# EasyEDA schematic Heizoel.Fuellstand.json
TITLE: Heizoel.Fuellstand; REV: 1.0; Date: 2019-01-28; Sheet: 1/1; Drawn By: Stefan Burkhardt; Company: Private
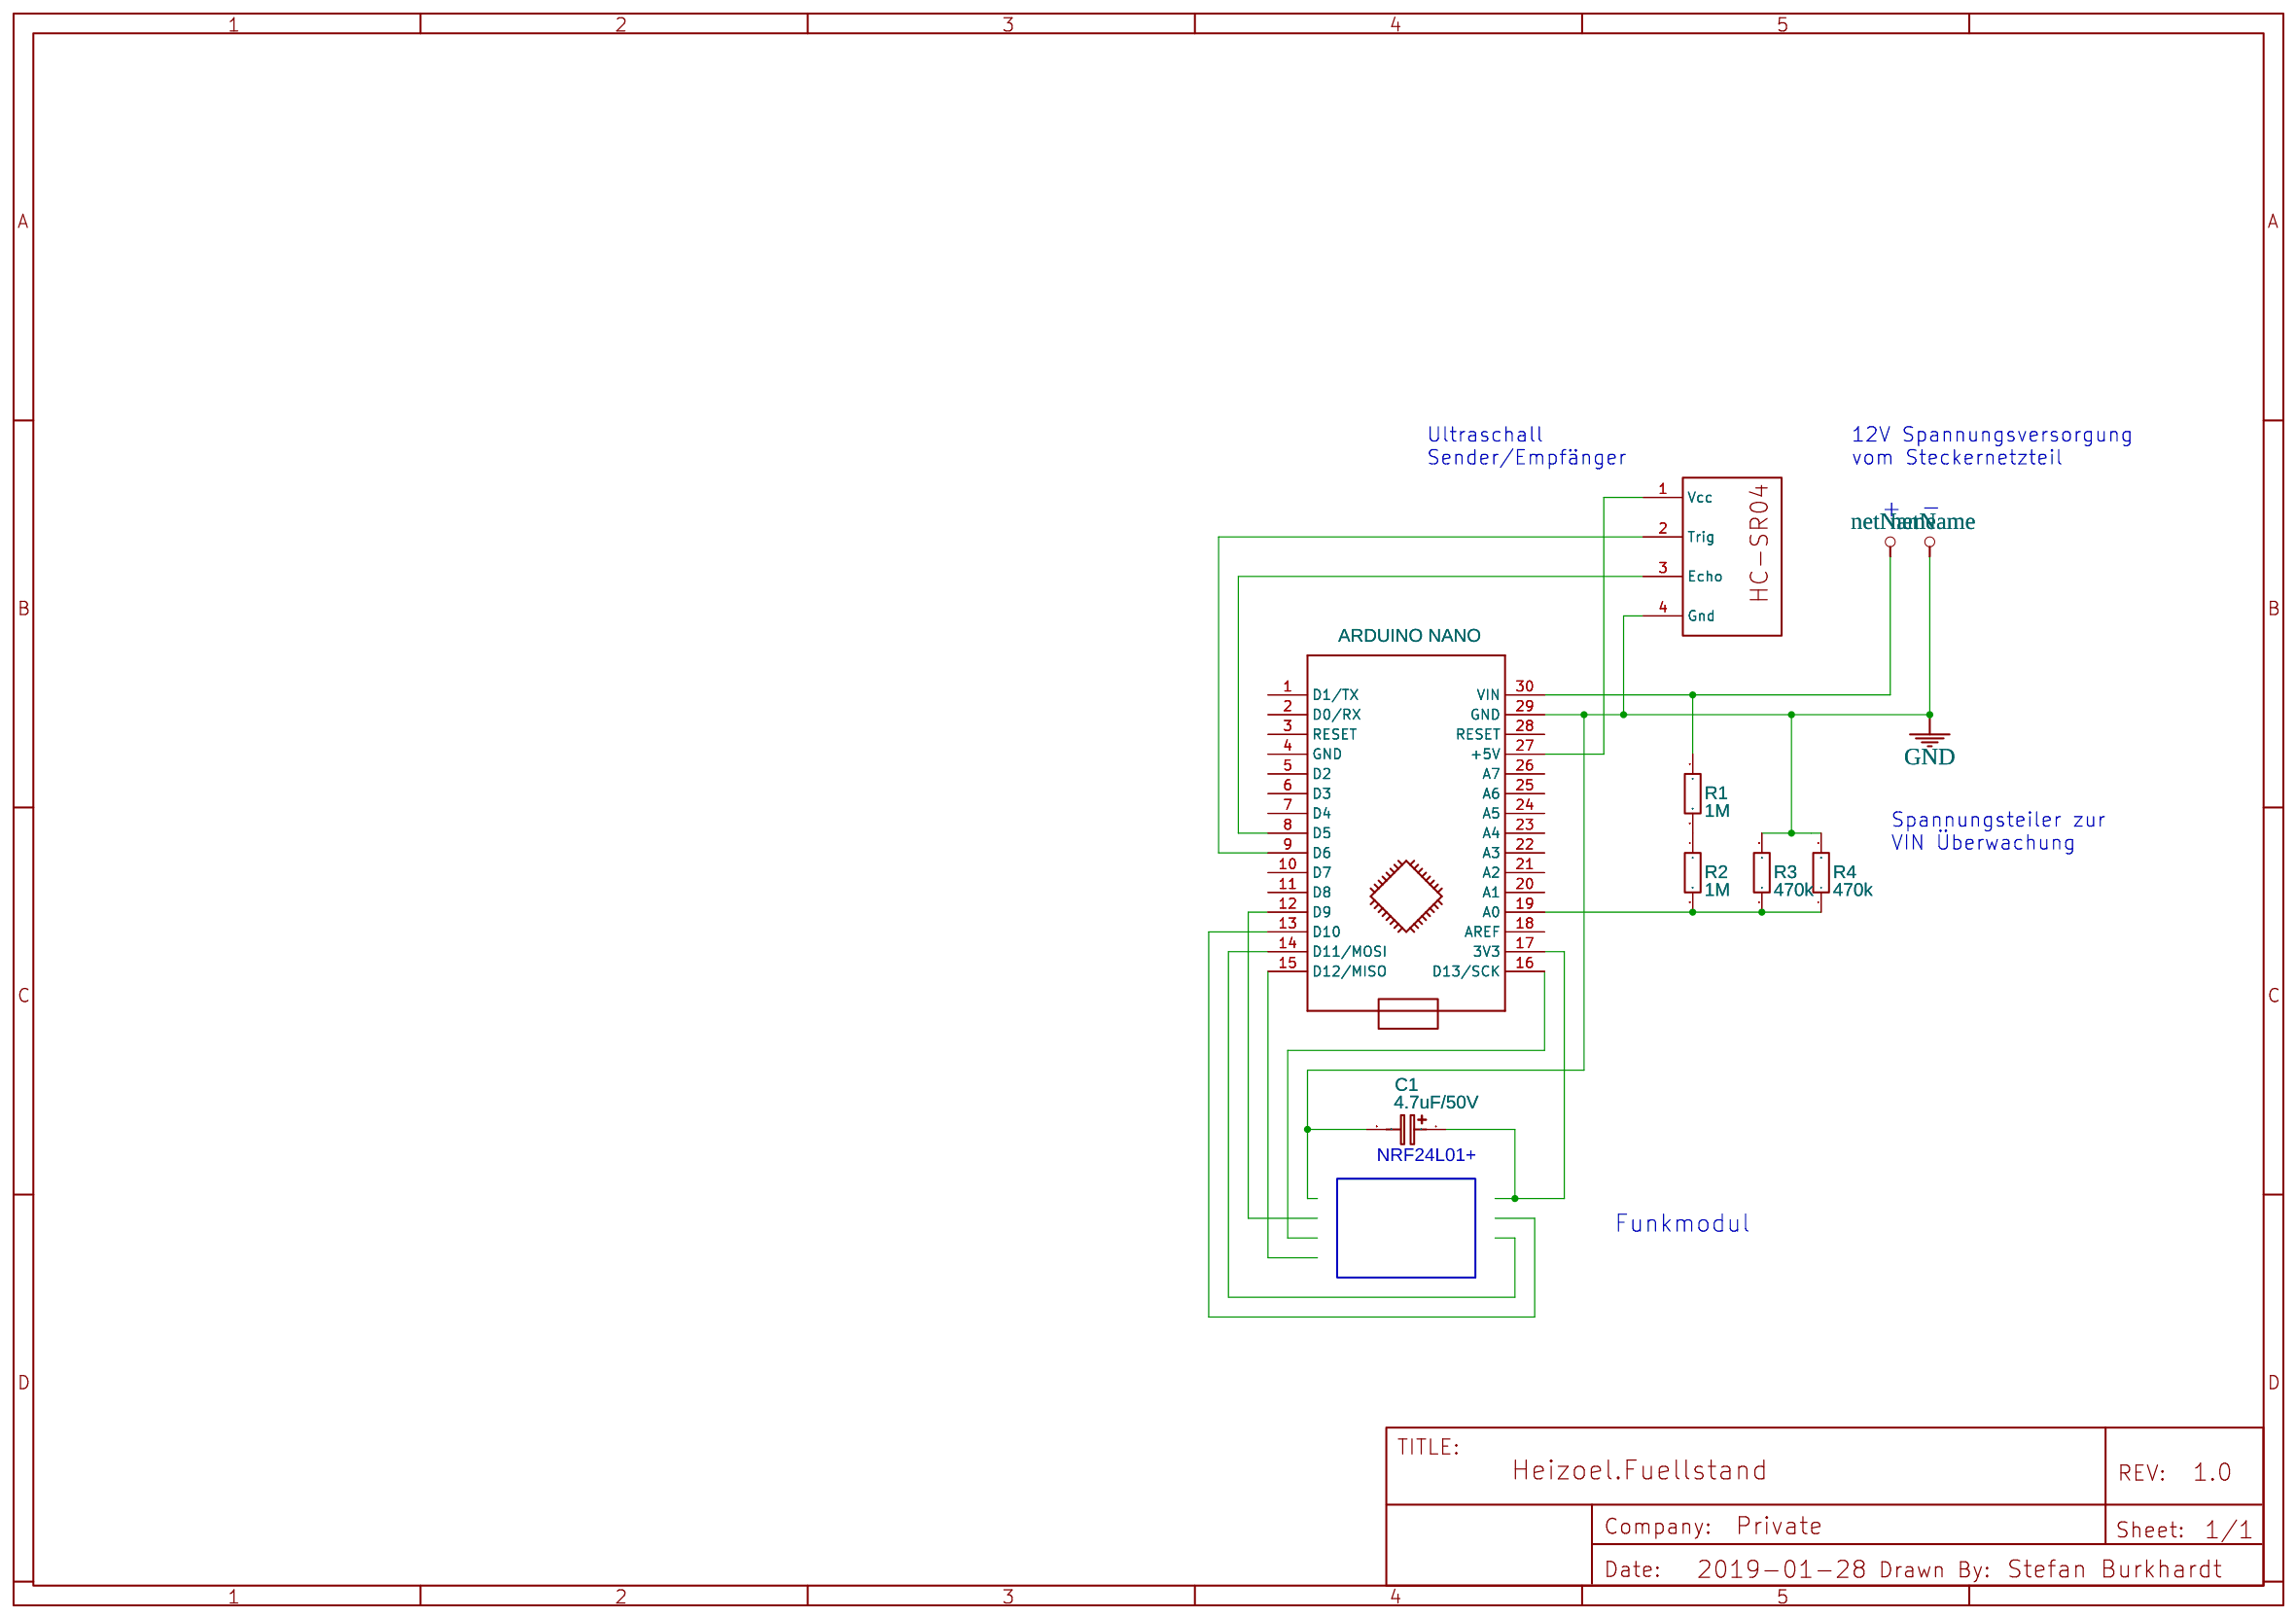
[diagram p0: schematic sheet]

## Parts
C1  4.7uF/50V  [CAP-D3.0XF1.5]
R1  1M  [AXIAL-0.3]
R2  1M  [AXIAL-0.3]
R3  470k  [AXIAL-0.3]
R4  470k  [AXIAL-0.3]
U1  ARDUINO NANO  [ARDUINO_NANO]
U3  HC-SR04

## Library data of the parts
C1 = Cap_Electrolytic(TH)_D3.0XF1.5_EU: Contributor: EasyEDA; Manufacturer Part: ?
R1-R4 = Res_AXIAL-0.3(1/8W)_EU: Manufacturer Part: ?
U1 = -: sourceId: KGSeAWhDB; Manufacturer Part: ?
U3 = -: Contributor: MrSpock

## Nets
GND: C1.2 R1.1 R3.2 R4.2 U1.29(GND) U1.30(VIN) U3.4(Gnd)
Net-(C1-1): C1.1 U1.17(3V3)
Net-(R1-2): R1.2 R2.1
Net-(R2-2): R2.2 R3.1 R4.1 U1.19(A0)
Net-(U1-8): U1.8(D5) U3.3(Echo)
Net-(U1-9): U1.9(D6) U3.2(Trig)
Net-(U1-27): U1.27(+5V) U3.1(Vcc)

Not connected (* = marked no-connect by the designer): U1 1(D1/TX) 2(D0/RX) 3(RESET) 4(GND) 5(D2) 6(D3) 7(D4) 10(D7) 11(D8) 12(D9) 13(D10) 14(D11/MOSI) 15(D12/MISO) 16(D13/SCK) 18(AREF) 20(A1) 21(A2) 22(A3) 23(A4) 24(A5) 25(A6) 26(A7) 28(RESET)

## Notes on the sheet
- Ultraschall
  Sender/Empfänger
- 12V Spannungsversorgung
  vom Steckernetzteil
- +
- -
- Spannungsteiler zur
  VIN Überwachung
- NRF24L01+
- Funkmodul
